# Altium schematic sheet fmc.SchDoc
size A3
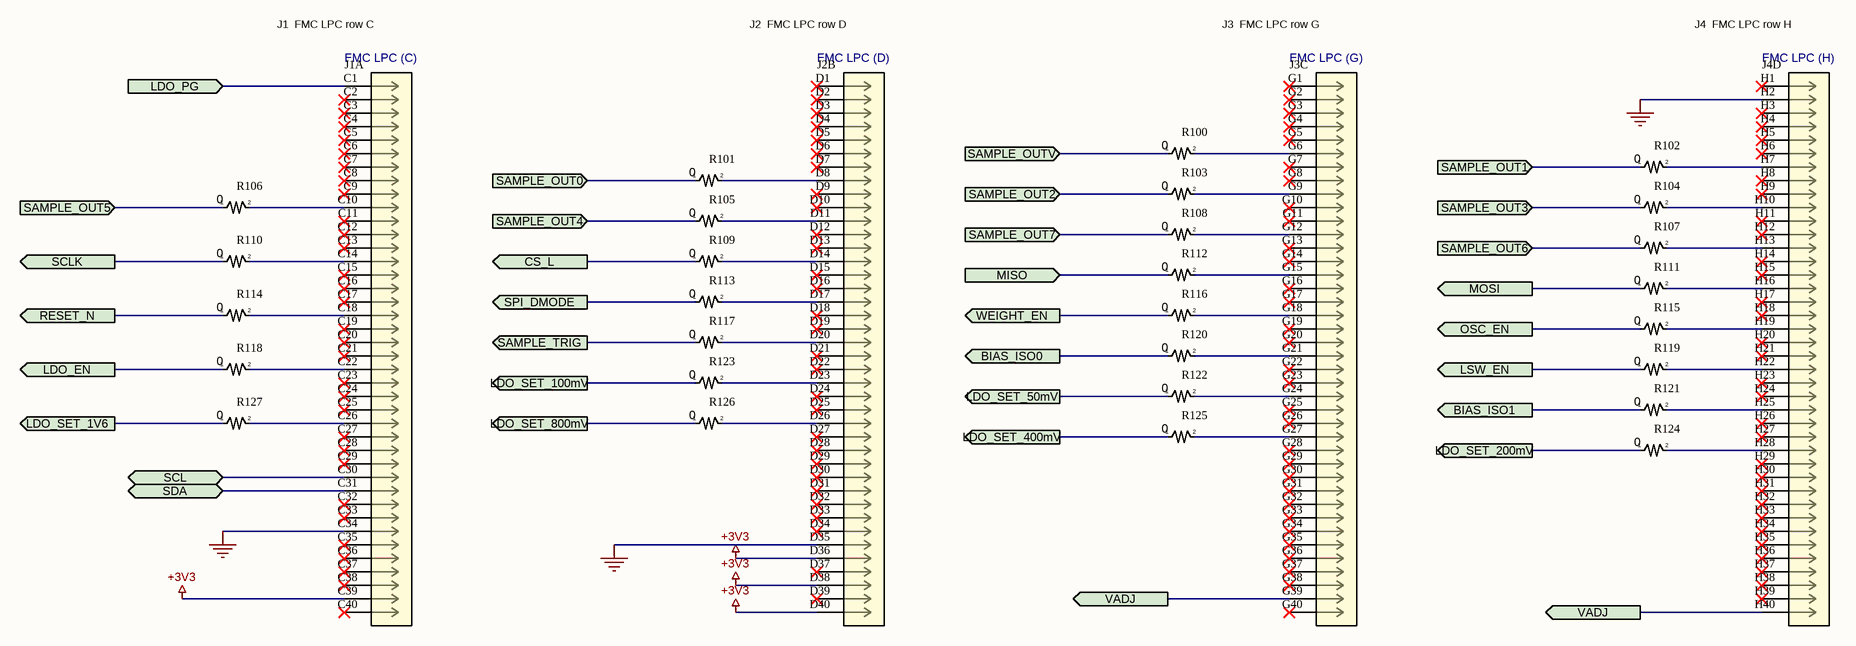
[diagram p0: fmc.SchDoc]

## Parts
J1  FMC LPC (C)  (part A of 3)
J2  FMC LPC (D)  (part B of 3)
J3  FMC LPC (G)  (part C of 3)
J4  FMC LPC (H)  (part D of 3)
R100  0
R101  0
R102  0
R103  0
R104  0
R105  0
R106  0
R107  0
R108  0
R109  0
R110  0
R111  0
R112  0
R113  0
R114  0
R115  0
R116  0
R117  0
R118  0
R119  0
R120  0
R121  0
R122  0
R123  0
R124  0
R125  0
R126  0
R127  0

## Ports
BIAS_ISO0 (out), BIAS_ISO1 (out), CS_L (out), LDO_EN (out), LDO_PG (in), LDO_SET_1V6 (out), LDO_SET_50mV (out), LDO_SET_100mV (out), LDO_SET_200mV (out), LDO_SET_400mV (out), LDO_SET_800mV (out), LSW_EN (out), MISO (in), MOSI (out), OSC_EN (out), RESET_N (out), SAMPLE_OUT0 (in), SAMPLE_OUT1 (in), SAMPLE_OUT2 (in), SAMPLE_OUT3 (in), SAMPLE_OUT4 (in), SAMPLE_OUT5 (in), SAMPLE_OUT6 (in), SAMPLE_OUT7 (in), SAMPLE_OUTV (in), SAMPLE_TRIG (out), SCL (bidir), SCLK (out), SDA (bidir), SPI_DMODE (out), VADJ (out), WEIGHT_EN (out)

## Nets
+3V3: J1.C39 J2.D36 J2.D38 J2.D40
GND: J1.C34 J2.D35 J4.H2
BIAS_ISO0: R120.1 ; port BIAS_ISO0
BIAS_ISO1: R121.1 ; port BIAS_ISO1
CS_L: R109.1 ; port CS_L
LDO_EN: R118.1 ; port LDO_EN
LDO_PG: J1.C1 ; port LDO_PG
LDO_SET_1V6: R127.1 ; port LDO_SET_1V6
LDO_SET_50mV: R122.1 ; port LDO_SET_50mV
LDO_SET_100mV: R123.1 ; port LDO_SET_100mV
LDO_SET_200mV: R124.1 ; port LDO_SET_200mV
LDO_SET_400mV: R125.1 ; port LDO_SET_400mV
LDO_SET_800mV: R126.1 ; port LDO_SET_800mV
LSW_EN: R119.1 ; port LSW_EN
MISO: R112.1 ; port MISO
MOSI: R111.1 ; port MOSI
OSC_EN: R115.1 ; port OSC_EN
RESET_N: R114.1 ; port RESET_N
SAMPLE_OUT0: R101.1 ; port SAMPLE_OUT0
SAMPLE_OUT1: R102.1 ; port SAMPLE_OUT1
SAMPLE_OUT2: R103.1 ; port SAMPLE_OUT2
SAMPLE_OUT3: R104.1 ; port SAMPLE_OUT3
SAMPLE_OUT4: R105.1 ; port SAMPLE_OUT4
SAMPLE_OUT5: R106.1 ; port SAMPLE_OUT5
SAMPLE_OUT6: R107.1 ; port SAMPLE_OUT6
SAMPLE_OUT7: R108.1 ; port SAMPLE_OUT7
SAMPLE_OUTV: R100.1 ; port SAMPLE_OUTV
SAMPLE_TRIG: R117.1 ; port SAMPLE_TRIG
SCL: J1.C30 ; port SCL
SCLK: R110.1 ; port SCLK
SDA: J1.C31 ; port SDA
SPI_DMODE: R113.1 ; port SPI_DMODE
VADJ: J3.G39 J4.H40 ; port VADJ
WEIGHT_EN: R116.1 ; port WEIGHT_EN
NetJ1_C10: J1.C10 R106.2
NetJ1_C14: J1.C14 R110.2
NetJ1_C18: J1.C18 R114.2
NetJ1_C22: J1.C22 R118.2
NetJ1_C26: J1.C26 R127.2
NetJ2_D8: J2.D8 R101.2
NetJ2_D11: J2.D11 R105.2
NetJ2_D14: J2.D14 R109.2
NetJ2_D17: J2.D17 R113.2
NetJ2_D20: J2.D20 R117.2
NetJ2_D23: J2.D23 R123.2
NetJ2_D26: J2.D26 R126.2
NetJ3_G6: J3.G6 R100.2
NetJ3_G9: J3.G9 R103.2
NetJ3_G12: J3.G12 R108.2
NetJ3_G15: J3.G15 R112.2
NetJ3_G18: J3.G18 R116.2
NetJ3_G21: J3.G21 R120.2
NetJ3_G24: J3.G24 R122.2
NetJ3_G27: J3.G27 R125.2
NetJ4_H7: J4.H7 R102.2
NetJ4_H10: J4.H10 R104.2
NetJ4_H13: J4.H13 R107.2
NetJ4_H16: J4.H16 R111.2
NetJ4_H19: J4.H19 R115.2
NetJ4_H22: J4.H22 R119.2
NetJ4_H25: J4.H25 R121.2
NetJ4_H28: J4.H28 R124.2

Not connected (* = marked no-connect by the designer): J1 C2* C3* C4* C5* C6* C7* C8* C9* C11* C12* C13* C15* C16* C17* C19* C20* C21* C23* C24* C25* C27* C28* C29* C32* C33* C35* C36* C37* C38* C40*; J2 D1* D2* D3* D4* D5* D6* D7* D9* D10* D12* D13* D15* D16* D18* D19* D21* D22* D24* D25* D27* D28* D29* D30* D31* D32* D33* D34* D37* D39*; J3 G1* G2* G3* G4* G5* G7* G8* G10* G11* G13* G14* G16* G17* G19* G20* G22* G23* G25* G26* G28* G29* G30* G31* G32* G33* G34* G35* G36* G37* G38* G40*; J4 H1* H3* H4* H5* H6* H8* H9* H11* H12* H14* H15* H17* H18* H20* H21* H23* H24* H26* H27* H29* H30* H31* H32* H33* H34* H35* H36* H37* H38* H39*

## Notes on the sheet
- J1  FMC LPC row C
- J2  FMC LPC row D
- J3  FMC LPC row G
- J4  FMC LPC row H

## Library data of the parts
J1-J4 = ASP-134606-01: Description; Manufacturer_Name: Samtec Inc; Type: Arrays, Edge Type, Mezzanine (Board to Board); Copyright: Copyright (C) 2025 Ultra Librarian. All rights reserved.; Manufacturer_Part_Number: ASP-134606-01; RefDes: RefDes
R100-R127 = CRCW04020000Z0ED: D10/CRCW0402 0R0 ET7 e3; Manufacturer_Name: Vishay; Manufacturer_Part_Number: CRCW04020000Z0ED